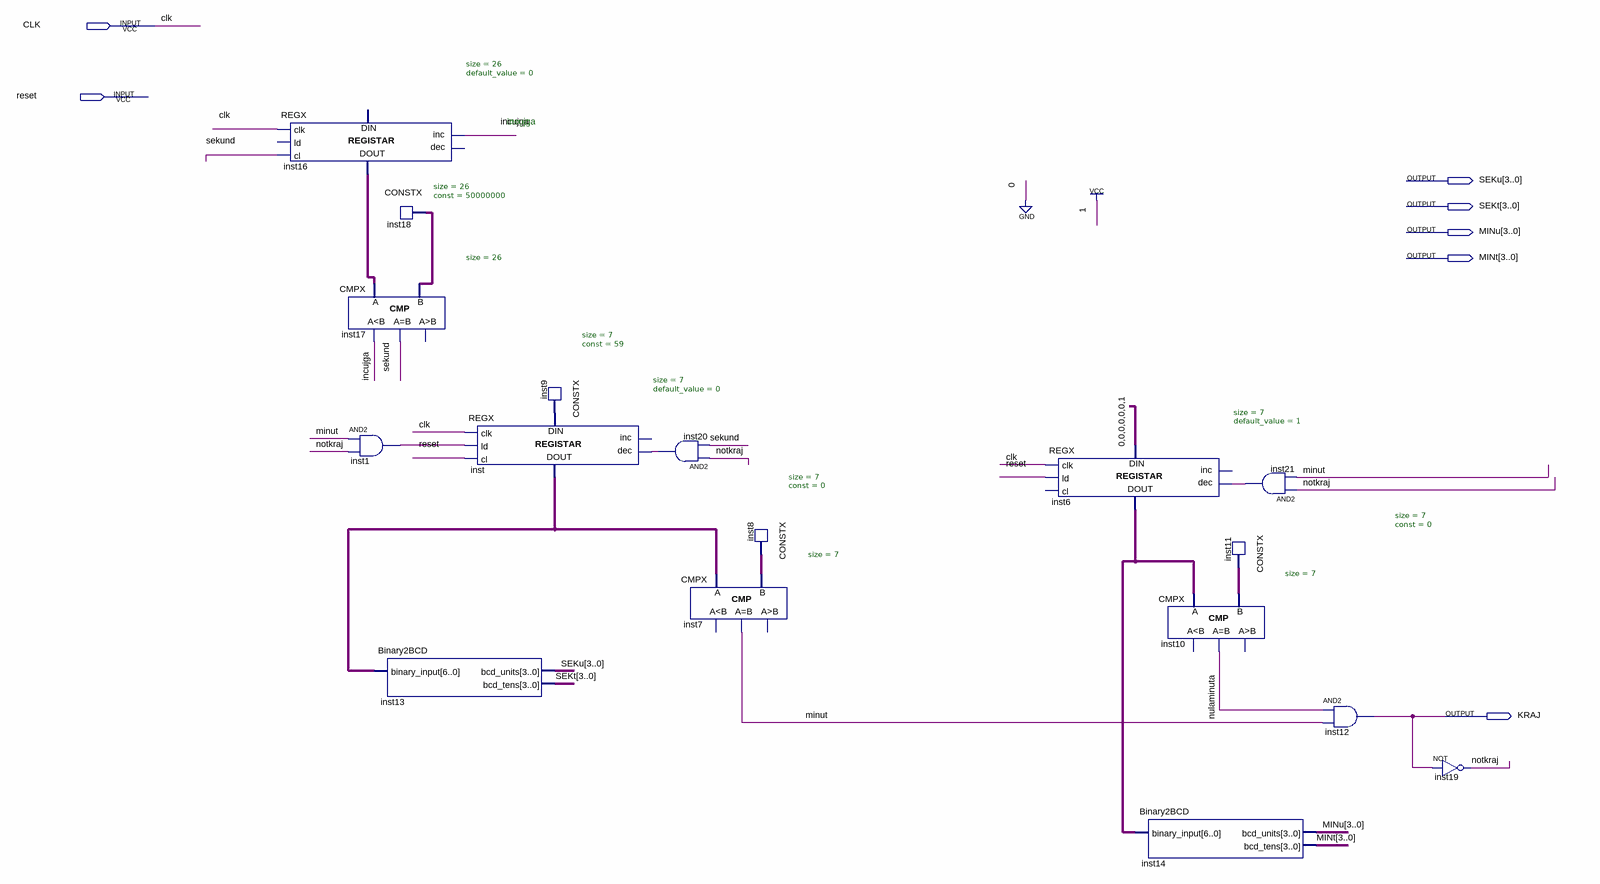
[diagram p0: schematic sheet]
// Quartus schematic realniTajmer.bdf as structural Verilog: 17 symbols, 7 pins
module realniTajmer (
  input  CLK,
  input  reset,
  output [3:0] SEKu,
  output [3:0] SEKt,
  output [3:0] MINu,
  output [3:0] MINt,
  output KRAJ
);

  wire incujga, inst1_out, inst20_out, inst21_out, minut, notkraj, nulaminuta, sekund;
  wire [6:0] inst6_data_out, inst8_data, inst9_data, inst11_data, inst_data_out;
  wire [25:0] inst16_data_out, inst18_data;

  REGX #(.size(26), .default_value(0)) inst16 (
    .clk(CLK), .cl(sekund), .inc(incujga), .data_out(inst16_data_out));  // open: ld, dec, data_in
  CMPX #(.size(26)) inst17 (.A(inst16_data_out), .B(inst18_data), .ls(incujga), .eq(sekund));  // open: gr
  and inst1 (inst1_out, minut, notkraj);
  CONSTX #(.size(26), .\const (50000000)) inst18 (.data(inst18_data));
  Binary2BCD inst13 (.binary_input(inst_data_out), .bcd_units(SEKu), .bcd_tens(SEKt));
  REGX #(.size(7), .default_value(0)) inst (
    .clk(CLK), .ld(inst1_out), .cl(reset), .dec(inst20_out), .data_in(inst9_data), .data_out(inst_data_out));  // open: inc
  CONSTX #(.size(7), .\const (59)) inst9 (.data(inst9_data));
  and inst20 (inst20_out, notkraj, sekund);
  CMPX #(.size(7)) inst7 (.A(inst_data_out), .B(inst8_data), .eq(minut));  // open: ls, gr
  CONSTX #(.size(7), .\const (0)) inst8 (.data(inst8_data));
  REGX #(.size(7), .default_value(1)) inst6 (
    .clk(CLK), .ld(reset), .dec(inst21_out), .data_in(7'b0000001), .data_out(inst6_data_out));  // open: cl, inc
  CMPX #(.size(7)) inst10 (.A(inst6_data_out), .B(inst11_data), .eq(nulaminuta));  // open: ls, gr
  Binary2BCD inst14 (.binary_input(inst6_data_out), .bcd_units(MINu), .bcd_tens(MINt));
  CONSTX #(.size(7), .\const (0)) inst11 (.data(inst11_data));
  and inst21 (inst21_out, notkraj, minut);
  and inst12 (KRAJ, nulaminuta, minut);
  not inst19 (notkraj, KRAJ);

  // Notes on the sheet:
  //   incujga
endmodule
